# Altium project carrier board Ultrafiltrasi.PrjPCB
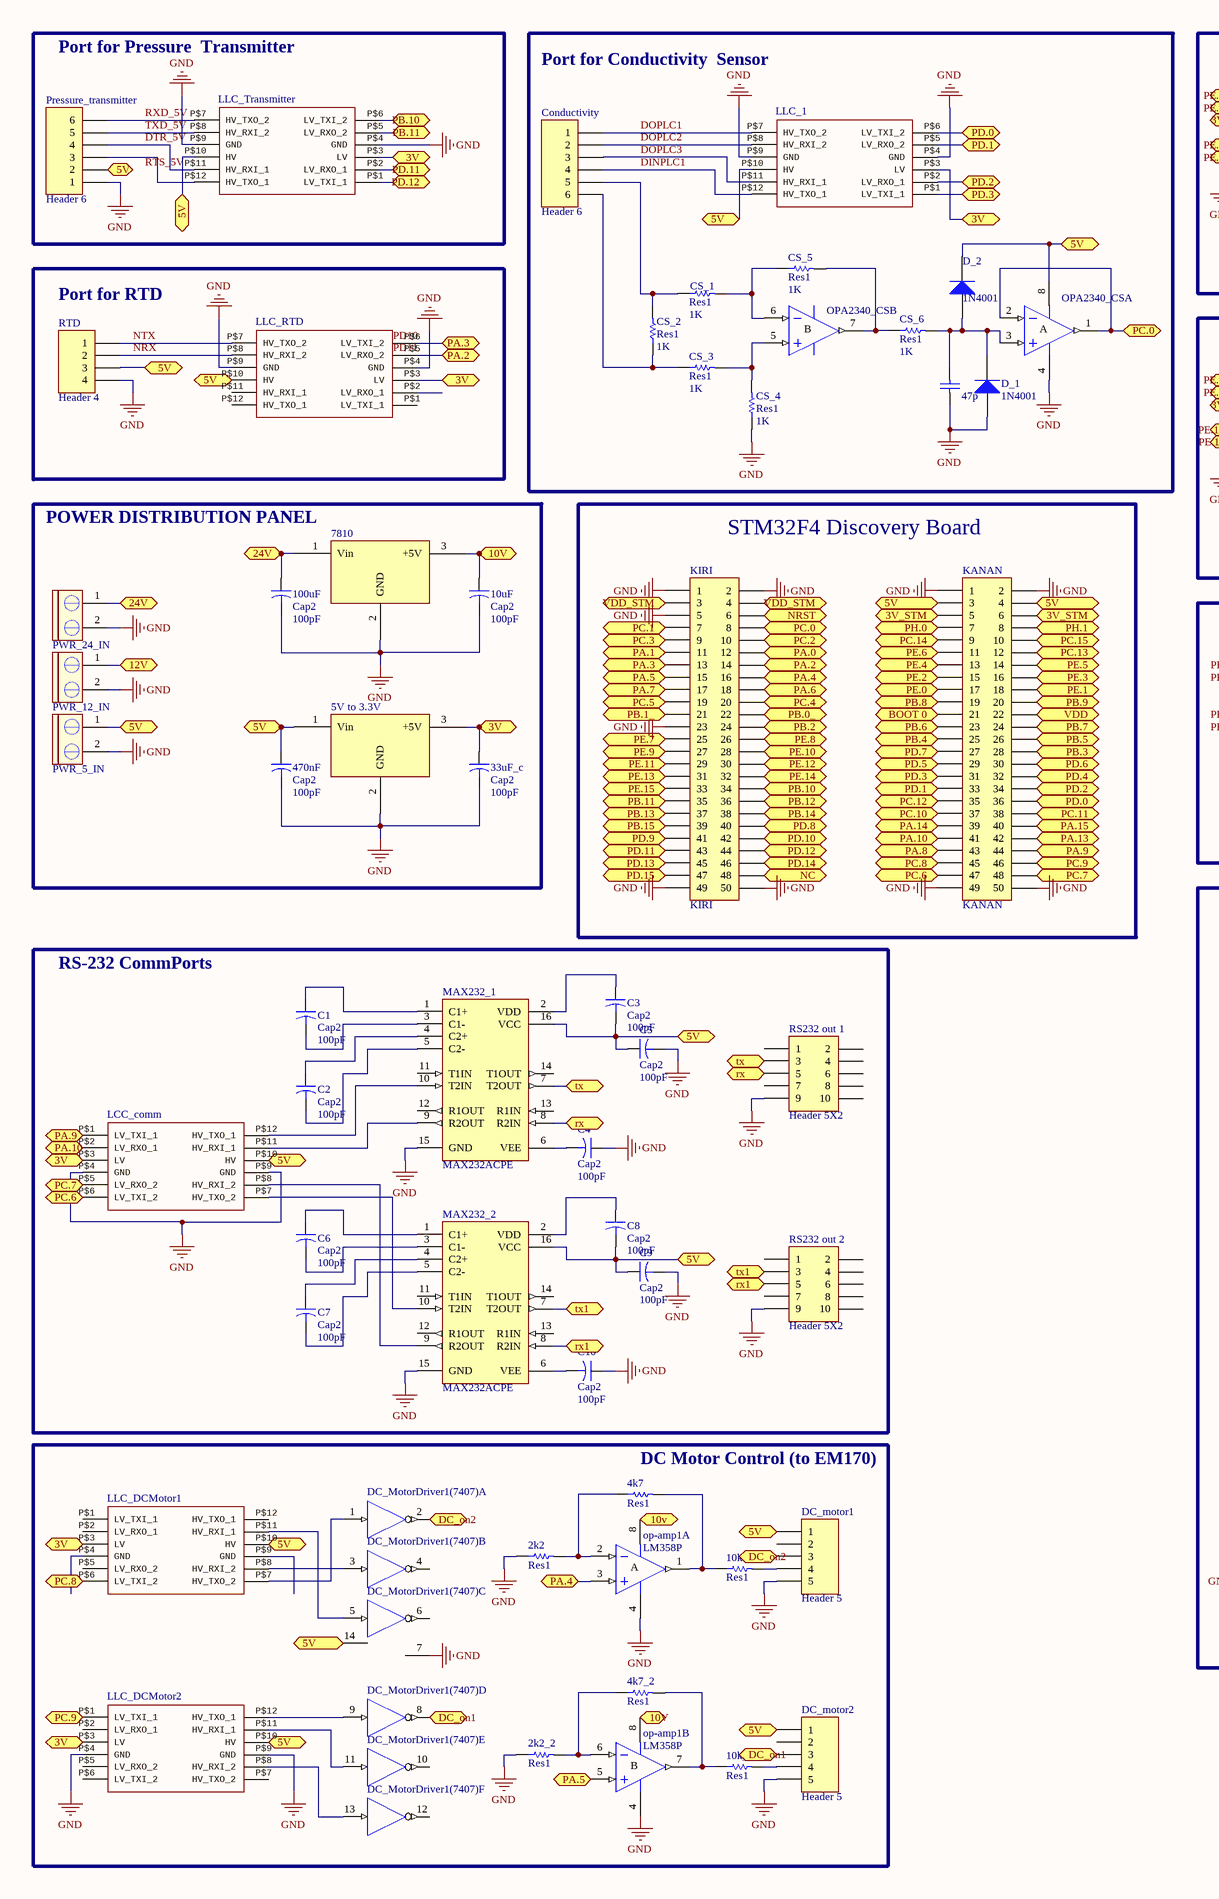
[diagram p0: carrier board Ultrafiltrasi.SchDoc, left]
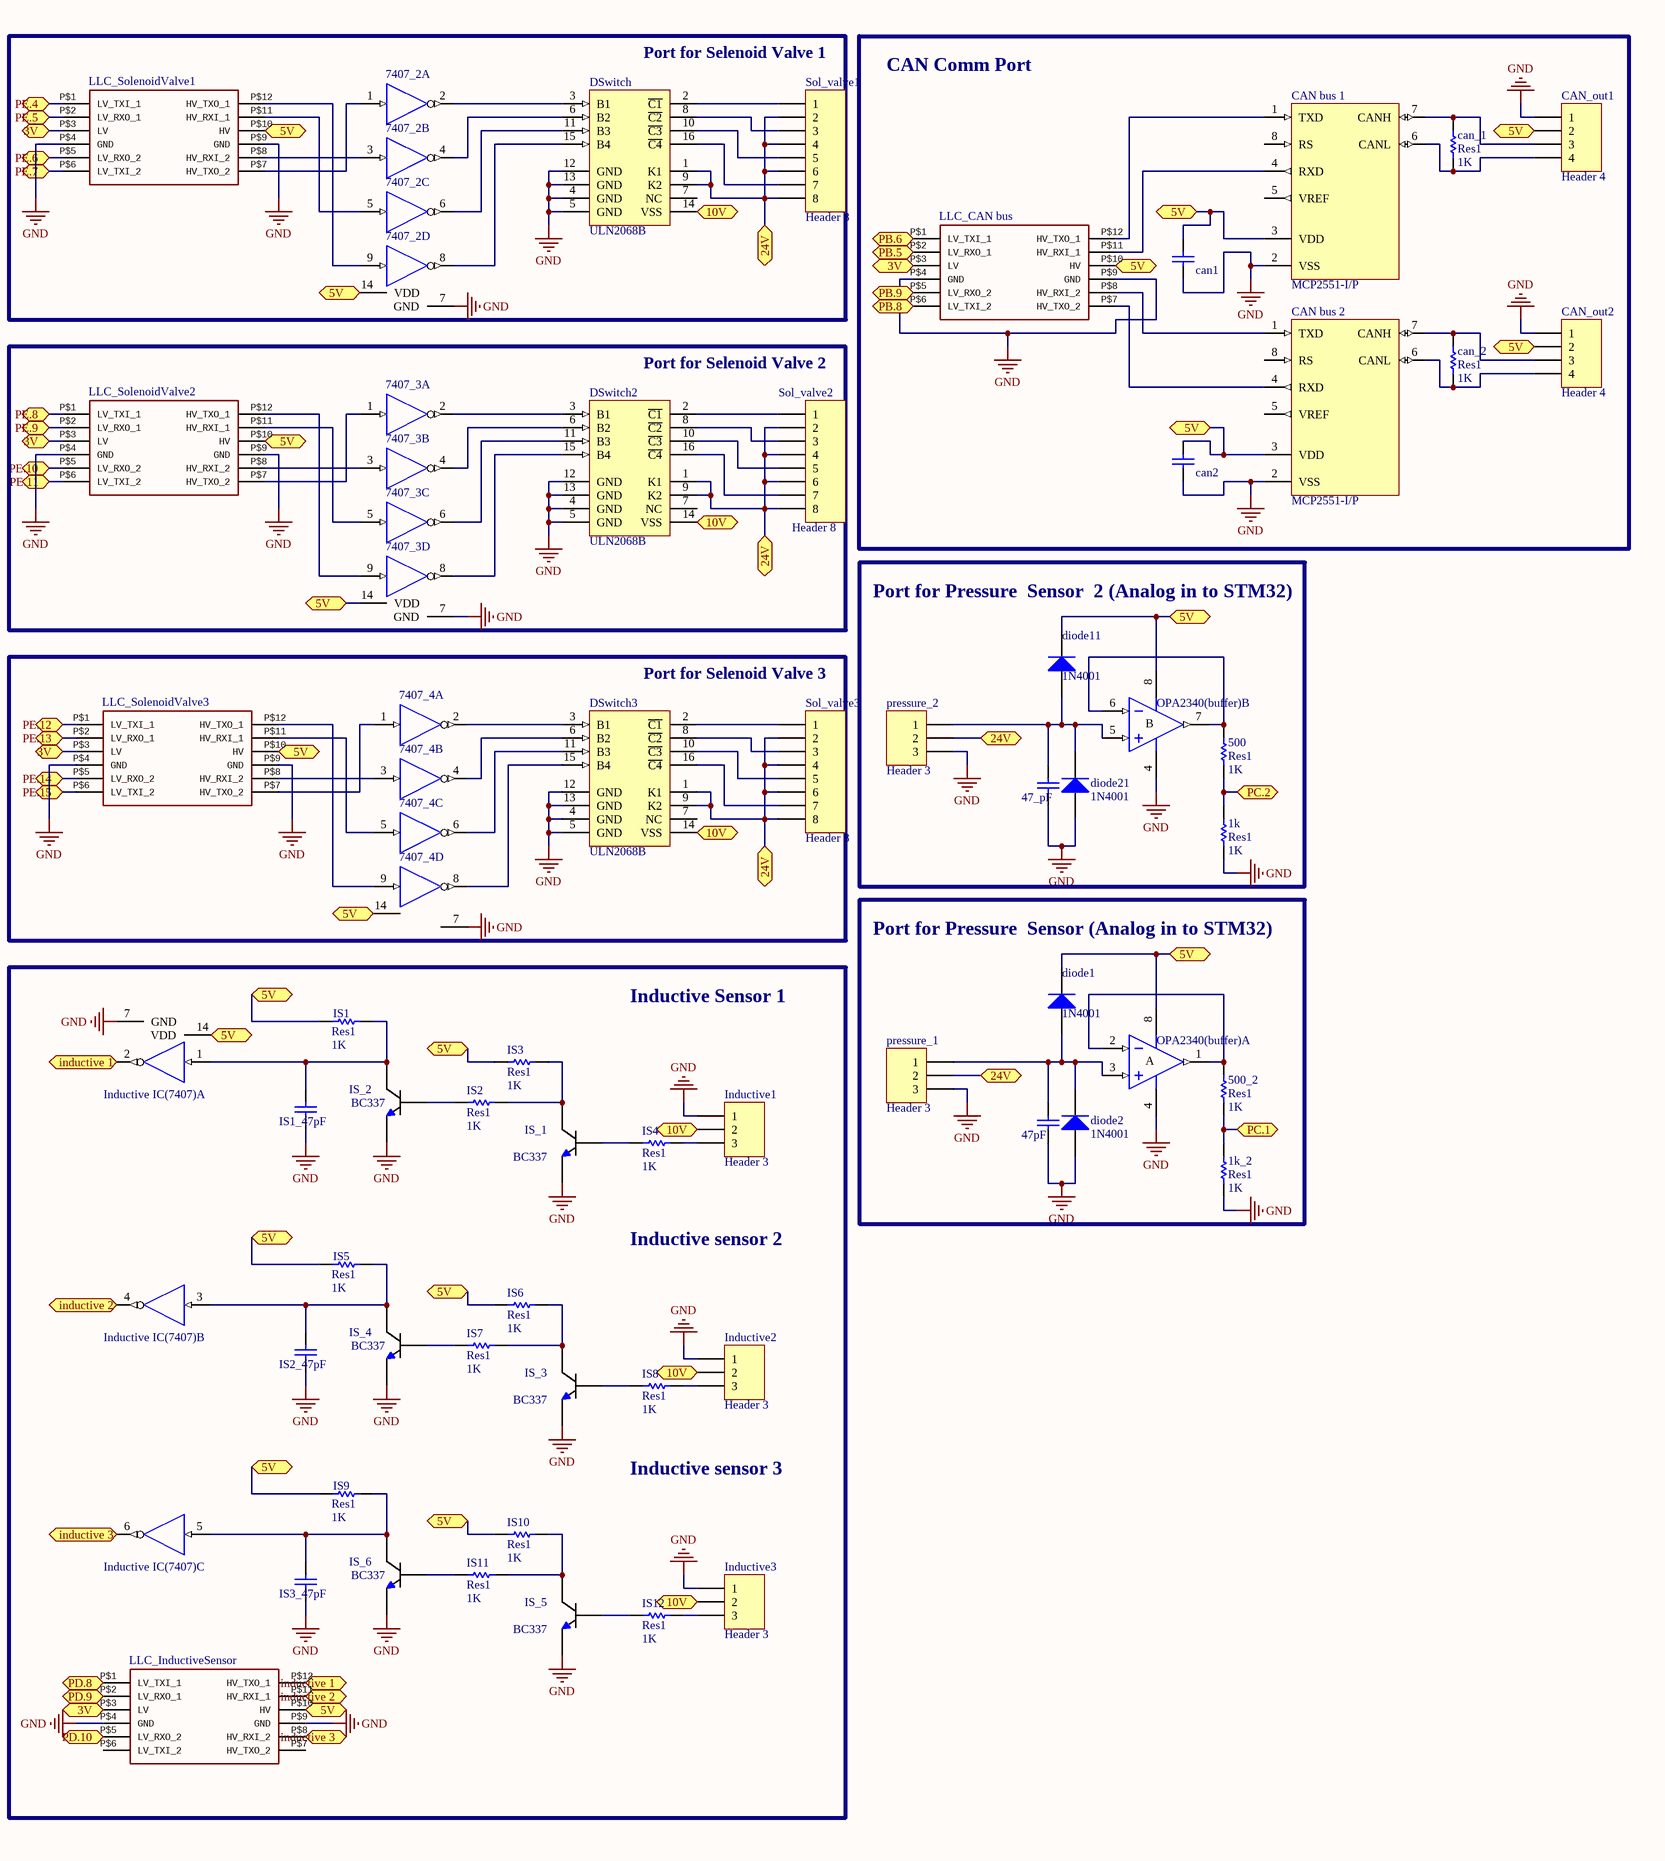
[diagram p1: carrier board Ultrafiltrasi.SchDoc, right]
1 sheet, 114 parts. Net scope: flat (ports and power ports of the same name join across sheets).
Board file: carrier board Ultrafiltrasi.PcbDoc

## Sheet carrier board Ultrafiltrasi.SchDoc: Carrier Board Ultrafiltrasi
size A2

### Parts
1k  Res1  value 1K  [AXIAL-0.3]
1k_2  Res1  value 1K  [AXIAL-0.3]
2k2  Res1  [AXIAL-0.3]
2k2_2  Res1  [AXIAL-0.3]
4k7  Res1  [AXIAL-0.3]
4k7_2  Res1  [AXIAL-0.3]
5V_to_3.3V  7805  [My_TO-220]  (value not drawn)
10k  Res1  [AXIAL-0.3]
10k_2  Res1  [AXIAL-0.3]
10uF  Cap2  value 100pF  [CAPR5-4X5]
33uF_c  Cap2  value 100pF  [CAPR5-4X5]
47_pF  Cap  [My_cap100n]  (value not drawn)
47p  Cap  [My_cap100n]  (value not drawn)
47pF  Cap  [My_cap100n]  (value not drawn)
100uF  Cap2  value 100pF  [CAPR5-4X5]
470nF  Cap2  value 100pF  [CAPR5-4X5]
500  Res1  value 1K  [AXIAL-0.3]
500_2  Res1  value 1K  [AXIAL-0.3]
7407_2  7407  [646-06]  (value not drawn)  (parts A,B,C,D of 6)
7407_3  7407  [646-06]  (value not drawn)  (parts A,B,C,D of 6)
7407_4  7407  [646-06]  (value not drawn)  (parts A,B,C,D of 6)
7810  7805  [My_TO-220]  (value not drawn)
C1  Cap2  value 100pF  [CAPR5-4X5]
C2  Cap2  value 100pF  [CAPR5-4X5]
C3  Cap2  value 100pF  [CAPR5-4X5]
C4  Cap2  value 100pF  [CAPR5-4X5]
C5  Cap2  value 100pF  [CAPR5-4X5]
C6  Cap2  value 100pF  [CAPR5-4X5]
C7  Cap2  value 100pF  [CAPR5-4X5]
C8  Cap2  value 100pF  [CAPR5-4X5]
C9  Cap2  value 100pF  [CAPR5-4X5]
C10  Cap2  value 100pF  [CAPR5-4X5]
can1  Cap  [My_cap100n]  (value not drawn)
can2  Cap  [My_cap100n]  (value not drawn)
can_1  Res1  value 1K  [AXIAL-0.3]
can_2  Res1  value 1K  [AXIAL-0.3]
CAN_bus_1  MCP2551-I/P  [PDIP300-P8]
CAN_bus_2  MCP2551-I/P  [PDIP300-P8]
CAN_out1  Header 4  [HDR1X4]
CAN_out2  Header 4  [HDR1X4]
Conductivity  Header 6  [HDR1X6]
CS_1  Res1  value 1K  [AXIAL-0.3]
CS_2  Res1  value 1K  [AXIAL-0.3]
CS_3  Res1  value 1K  [AXIAL-0.3]
CS_4  Res1  value 1K  [AXIAL-0.3]
CS_5  Res1  value 1K  [AXIAL-0.3]
CS_6  Res1  value 1K  [AXIAL-0.3]
D_1  1N4001  [DO-41]
D_2  1N4001  [DO-41]
DC_motor1  Header 5  [HDR1X5]
DC_motor2  Header 5  [HDR1X5]
DC_MotorDriver1(7407)  SN74LS14N  [646-06]  (value not drawn)  (parts A,B,C,D,E,F of 6)
diode1  1N4001  [DO-41]
diode2  1N4001  [DO-41]
diode11  1N4001  [DO-41]
diode21  1N4001  [DO-41]
DSwitch  ULN2068B  [648C-02]
DSwitch2  ULN2068B  [648C-02]
DSwitch3  ULN2068B  [648C-02]
Inductive1  Header 3  [HDR1X3]
Inductive2  Header 3  [HDR1X3]
Inductive3  Header 3  [HDR1X3]
Inductive_IC(7407)  SN74LS14N  [646-06]  (value not drawn)  (parts A,B,C of 6)
IS1  Res1  value 1K  [AXIAL-0.3]
IS1_47pF  Cap  [My_cap100n]  (value not drawn)
IS2  Res1  value 1K  [AXIAL-0.3]
IS2_47pF  Cap  [My_cap100n]  (value not drawn)
IS3  Res1  value 1K  [AXIAL-0.3]
IS3_47pF  Cap  [My_cap100n]  (value not drawn)
IS4  Res1  value 1K  [AXIAL-0.3]
IS5  Res1  value 1K  [AXIAL-0.3]
IS6  Res1  value 1K  [AXIAL-0.3]
IS7  Res1  value 1K  [AXIAL-0.3]
IS8  Res1  value 1K  [AXIAL-0.3]
IS9  Res1  value 1K  [AXIAL-0.3]
IS10  Res1  value 1K  [AXIAL-0.3]
IS11  Res1  value 1K  [AXIAL-0.3]
IS12  Res1  value 1K  [AXIAL-0.3]
IS_1  BC337  [E3]
IS_2  BC337  [TO-92]
IS_3  BC337  [TO-92]
IS_4  BC337  [transistor]
IS_5  BC337  [TO-92]
IS_6  BC337  [TO-92]
KANAN  KANAN  [HDR2X25]
KIRI  KIRI  [HDR2X25]
LCC_comm  Logic Level Converter (3.3v - 5v) / https://www.sparkfun.com/products/8745  [LOGIC_LEVEL_CONVERTER]  (value not drawn)
LLC_1  Logic Level Converter (3.3v - 5v) / https://www.sparkfun.com/products/8745  [LOGIC_LEVEL_CONVERTER]  (value not drawn)
LLC_CAN_bus  Logic Level Converter (3.3v - 5v) / https://www.sparkfun.com/products/8745  [LOGIC_LEVEL_CONVERTER]  (value not drawn)
LLC_DCMotor1  Logic Level Converter (3.3v - 5v) / https://www.sparkfun.com/products/8745  [LOGIC_LEVEL_CONVERTER]  (value not drawn)
LLC_DCMotor2  Logic Level Converter (3.3v - 5v) / https://www.sparkfun.com/products/8745  [LOGIC_LEVEL_CONVERTER]  (value not drawn)
LLC_InductiveSensor  Logic Level Converter (3.3v - 5v) / https://www.sparkfun.com/products/8745  [LOGIC_LEVEL_CONVERTER]  (value not drawn)
LLC_RTD  Logic Level Converter (3.3v - 5v) / https://www.sparkfun.com/products/8745  [LOGIC_LEVEL_CONVERTER]  (value not drawn)
LLC_SolenoidValve1  Logic Level Converter (3.3v - 5v) / https://www.sparkfun.com/products/8745  [LOGIC_LEVEL_CONVERTER]  (value not drawn)
LLC_SolenoidValve2  Logic Level Converter (3.3v - 5v) / https://www.sparkfun.com/products/8745  [LOGIC_LEVEL_CONVERTER]  (value not drawn)
LLC_SolenoidValve3  Logic Level Converter (3.3v - 5v) / https://www.sparkfun.com/products/8745  [LOGIC_LEVEL_CONVERTER]  (value not drawn)
LLC_Transmitter  Logic Level Converter (3.3v - 5v) / https://www.sparkfun.com/products/8745  [LOGIC_LEVEL_CONVERTER]  (value not drawn)
MAX232_1  MAX232ACPE  [PE16A]
MAX232_2  MAX232ACPE  [PE16A]
op-amp1  LM358P  [P008]  (parts A,B of 2)
OPA2340(buffer)  LM358P  [P008]  (value not drawn)  (parts A,B of 2)
OPA2340_CS  LM358P  [P008]  (value not drawn)  (parts A,B of 2)
pressure_1  Header 3  [HDR1X3]
pressure_2  Header 3  [HDR1X3]
Pressure_transmitter  Header 6  [HDR1X6]
PWR_5_IN  CON2 pin blue  [My_CN2]  (value not drawn)
PWR_12_IN  CON2 pin blue  [My_CN2]  (value not drawn)
PWR_24_IN  CON2 pin blue  [My_CN2]  (value not drawn)
RS232_out_1  Header 5X2  [HDR2X5]
RS232_out_2  Header 5X2  [HDR2X5]
RTD  Header 4  [HDR1X4]
Sol_valve1  Header 8  [HDR1X8]
Sol_valve2  Header 8  [HDR1X8]
Sol_valve3  Header 8  [HDR1X8]

### Blocks framed on the sheet
Port for Pressure  Transmitter: LLC_Transmitter Pressure_transmitter
Port for Conductivity  Sensor: 47p Conductivity CS_1-CS_6 D_1 D_2 LLC_1 OPA2340_CS
Port for Selenoid Valve 1: 7407_2 DSwitch LLC_SolenoidValve1 Sol_valve1
CAN Comm Port: can1 can2 can_1 can_2 CAN_bus_1 CAN_bus_2 CAN_out1 CAN_out2 LLC_CAN_bus
Port for RTD: LLC_RTD RTD
Port for Selenoid Valve 2: 7407_3 DSwitch2 LLC_SolenoidValve2 Sol_valve2
POWER DISTRIBUTION PANEL: 5V_to_3.3V 10uF 33uF_c 100uF 470nF 7810 PWR_5_IN PWR_12_IN PWR_24_IN
STM32F4 Discovery Board: KANAN KIRI
Port for Pressure  Sensor  2 (Analog in to STM32): 1k 47_pF 500 diode11 diode21 OPA2340(buffer) pressure_2
Port for Selenoid Valve 3: 7407_4 DSwitch3 LLC_SolenoidValve3 Sol_valve3
Port for Pressure  Sensor (Analog in to STM32): 1k_2 47pF 500_2 diode1 diode2 OPA2340(buffer) pressure_1
RS-232 CommPorts: C1-C10 LCC_comm MAX232_1 MAX232_2 RS232_out_1 RS232_out_2
DC Motor Control (to EM170): 2k2 2k2_2 4k7 4k7_2 10k 10k_2 DC_motor1 DC_motor2 DC_MotorDriver1(7407) LLC_DCMotor1 LLC_DCMotor2 op-amp1

### Ports
3V, 3V_STM, 5V, 10V, 10v, 12V, 24V, BOOT 0, DC_on1, DC_on2, inductive 1, inductive 2, inductive 3, NC, NRST, PA.0, PA.1, PA.2, PA.3, PA.4, PA.5, PA.6, PA.7, PA.8, PA.9, PA.10, PA.13, PA.14, PA.15, PB.0_, PB.1_, PB.2, PB.3, PB.4, PB.5, PB.6, PB.7, PB.8, PB.9, PB.10, PB.11, PB.12, PB.13, PB.14, PB.15, PC.0, PC.1, PC.2, PC.3, PC.4, PC.5, PC.6, PC.7, PC.8, PC.9, PC.10, PC.11, PC.12, PC.13, PC.14, PC.15, PD.0, PD.1, PD.2, PD.3, PD.4, PD.5, PD.6, PD.7, PD.8, PD.9, PD.10, PD.11, PD.12, PD.13, PD.14, PD.15, PE.0, PE.1, PE.2, PE.3, PE.4, PE.5, PE.6, PE.7, PE.8, PE.9, PE.10, PE.11, PE.12, PE.13, PE.14, PE.15, PH.0, PH.1, rx, rx1, tx, tx1, VDD, VDD_STM

### Nets
GND: 1k.1 1k_2.1 2k2.1 2k2_2.1 5V_to_3.3V.2(GND) 10uF.2 33uF_c.2 47_pF.1 47p.1 47pF.1 100uF.2 470nF.2 7407_2.7(GND) 7407_3.7(GND) 7407_4.7(GND) 7810.2(GND) C4.1 C5.2 C9.2 C10.1 can1.1 can2.1 CAN_bus_1.2(VSS) CAN_bus_2.2(VSS) CAN_out1.1 CAN_out2.1 CS_4.1 D_1.1(A) DC_motor1.5 DC_motor2.5 DC_MotorDriver1(7407).7(GND) diode2.1(A) diode21.1(A) DSwitch.4(GND) DSwitch.5(GND) DSwitch.12(GND) DSwitch.13(GND) DSwitch2.4(GND) DSwitch2.5(GND) DSwitch2.12(GND) DSwitch2.13(GND) DSwitch3.4(GND) DSwitch3.5(GND) DSwitch3.12(GND) DSwitch3.13(GND) Inductive1.1 Inductive2.1 Inductive3.1 Inductive_IC(7407).7(GND) IS1_47pF.1 IS2_47pF.1 IS3_47pF.1 IS_1.3(E) IS_2.3(E) IS_3.3(E) IS_4.3(E) IS_5.3(E) IS_6.3(E) KANAN.1 KANAN.2 KANAN.49 KANAN.50 KIRI.1 KIRI.2 KIRI.5 KIRI.23 KIRI.49 KIRI.50 LCC_comm.P$4(GND) LCC_comm.P$9(GND) LLC_1.P$4(GND) LLC_1.P$9(GND) LLC_CAN_bus.P$4(GND) LLC_CAN_bus.P$9(GND) LLC_DCMotor2.P$4(GND) LLC_DCMotor2.P$9(GND) LLC_InductiveSensor.P$4(GND) LLC_InductiveSensor.P$9(GND) LLC_RTD.P$4(GND) LLC_RTD.P$9(GND) LLC_SolenoidValve1.P$4(GND) LLC_SolenoidValve1.P$9(GND) LLC_SolenoidValve2.P$4(GND) LLC_SolenoidValve2.P$9(GND) LLC_SolenoidValve3.P$4(GND) LLC_SolenoidValve3.P$9(GND) LLC_Transmitter.P$4(GND) LLC_Transmitter.P$9(GND) MAX232_1.15(GND) MAX232_2.15(GND) op-amp1.4(V-) OPA2340(buffer).4(V-) OPA2340_CS.4(V-) pressure_1.3 pressure_2.3 Pressure_transmitter.1 PWR_5_IN.2 PWR_12_IN.2 PWR_24_IN.2 RS232_out_1.9 RS232_out_2.9 RTD.4
VDD: 7407_2.14(VDD) 7407_3.14(VDD) 7407_4.14(VDD) DC_MotorDriver1(7407).14(VDD) Inductive_IC(7407).14(VDD)
DINPLC1: Conductivity.4 LLC_1.P$12(HV_TXO_1)
DOPLC1: Conductivity.1 LLC_1.P$7(HV_TXO_2)
DOPLC2: Conductivity.2 LLC_1.P$8(HV_RXI_2)
DOPLC3: Conductivity.3 LLC_1.P$11(HV_RXI_1)
DTR_5V: LLC_Transmitter.P$11(HV_RXI_1) Pressure_transmitter.4
NRX: LLC_RTD.P$8(HV_RXI_2) RTD.2
NTX: LLC_RTD.P$7(HV_TXO_2) RTD.1
RXD_5V: LLC_Transmitter.P$7(HV_TXO_2) Pressure_transmitter.6
TXD_5V: LLC_Transmitter.P$8(HV_RXI_2) Pressure_transmitter.5
Net1k_2: 1k.2 500.1 KIRI.10 ; port PC.2
Net1k_2_2: 1k_2.2 500_2.1 KIRI.7 ; port PC.1
Net2k2_2: 2k2.2 4k7.1 op-amp1.2(IN-)
Net2k2_2_2: 2k2_2.2 4k7_2.1 op-amp1.6(IN-)
Net4k7_2: 4k7.2 10k.1 op-amp1.1(OUT)
Net4k7_2_2: 4k7_2.2 10k_2.1 op-amp1.7(OUT)
Net5V_to_3.3V_1: 5V_to_3.3V.1(Vin) 470nF.1 7407_2.14(VDD) 7407_3.14(VDD) 7407_4.14(VDD) C3.2 C5.1 C8.2 C9.1 can1.2 can2.2 CAN_bus_1.3(VDD) CAN_bus_2.3(VDD) CAN_out1.2 CAN_out2.2 D_2.2(K) DC_motor1.1 DC_motor2.1 DC_MotorDriver1(7407).14(VDD) diode1.2(K) diode11.2(K) Inductive_IC(7407).14(VDD) IS1.1 IS3.1 IS5.1 IS6.1 IS9.1 IS10.1 KANAN.3 KANAN.4 LCC_comm.P$10(HV) LLC_1.P$10(HV) LLC_CAN_bus.P$10(HV) LLC_DCMotor1.P$10(HV) LLC_DCMotor2.P$10(HV) LLC_InductiveSensor.P$10(HV) LLC_RTD.P$10(HV) LLC_SolenoidValve1.P$10(HV) LLC_SolenoidValve2.P$10(HV) LLC_SolenoidValve3.P$10(HV) LLC_Transmitter.P$10(HV) MAX232_1.16(VCC) MAX232_2.16(VCC) OPA2340(buffer).8(V+) OPA2340_CS.8(V+) Pressure_transmitter.2 PWR_5_IN.1 RTD.3 ; port 5V
Net5V_to_3.3V_3: 5V_to_3.3V.3(+5V) 33uF_c.1 LCC_comm.P$3(LV) LLC_1.P$3(LV) LLC_CAN_bus.P$3(LV) LLC_DCMotor1.P$3(LV) LLC_DCMotor2.P$3(LV) LLC_InductiveSensor.P$3(LV) LLC_RTD.P$3(LV) LLC_SolenoidValve1.P$3(LV) LLC_SolenoidValve2.P$3(LV) LLC_SolenoidValve3.P$3(LV) LLC_Transmitter.P$3(LV) ; port 3V
Net10k_2: 10k.2 DC_motor1.4
Net10k_2_2: 10k_2.2 DC_motor2.4
Net10uF_1: 10uF.1 7810.3(+5V) DSwitch.14(VSS) DSwitch2.14(VSS) DSwitch3.14(VSS) Inductive1.2 Inductive2.2 Inductive3.2 op-amp1.8(V+) ; port 10V, port 10v
Net47_pF_2: 47_pF.2 diode11.1(A) diode21.2(K) OPA2340(buffer).5(IN+) pressure_2.1
Net47p_2: 47p.2 CS_6.2 D_1.2(K) D_2.1(A) OPA2340_CS.3(IN+)
Net47pF_2: 47pF.2 diode1.1(A) diode2.2(K) OPA2340(buffer).3(IN+) pressure_1.1
Net100uF_1: 100uF.1 7810.1(Vin) DSwitch.1(K1) DSwitch.9(K2) DSwitch2.1(K1) DSwitch2.9(K2) DSwitch3.1(K1) DSwitch3.9(K2) pressure_1.2 pressure_2.2 PWR_24_IN.1 Sol_valve1.2 Sol_valve1.4 Sol_valve1.6 Sol_valve1.8 Sol_valve2.2 Sol_valve2.4 Sol_valve2.6 Sol_valve2.8 Sol_valve3.2 Sol_valve3.4 Sol_valve3.6 Sol_valve3.8 ; port 24V
Net500_2: 500.2 OPA2340(buffer).6(IN-) OPA2340(buffer).7(OUT)
Net500_2_2: 500_2.2 OPA2340(buffer).1(OUT) OPA2340(buffer).2(IN-)
Net7407_2_1: 7407_2.1(IN) LLC_SolenoidValve1.P$7(HV_TXO_2)
Net7407_2_2: 7407_2.2(~{OUT}) DSwitch.3(B1)
Net7407_2_3: 7407_2.3(IN) LLC_SolenoidValve1.P$8(HV_RXI_2)
Net7407_2_4: 7407_2.4(~{OUT}) DSwitch.6(B2)
Net7407_2_5: 7407_2.5(IN) LLC_SolenoidValve1.P$11(HV_RXI_1)
Net7407_2_6: 7407_2.6(~{OUT}) DSwitch.11(B3)
Net7407_2_8: 7407_2.8(~{OUT}) DSwitch.15(B4)
Net7407_2_9: 7407_2.9(IN) LLC_SolenoidValve1.P$12(HV_TXO_1)
Net7407_3_1: 7407_3.1(IN) LLC_SolenoidValve2.P$7(HV_TXO_2)
Net7407_3_2: 7407_3.2(~{OUT}) DSwitch2.3(B1)
Net7407_3_3: 7407_3.3(IN) LLC_SolenoidValve2.P$8(HV_RXI_2)
Net7407_3_4: 7407_3.4(~{OUT}) DSwitch2.6(B2)
Net7407_3_5: 7407_3.5(IN) LLC_SolenoidValve2.P$11(HV_RXI_1)
Net7407_3_6: 7407_3.6(~{OUT}) DSwitch2.11(B3)
Net7407_3_8: 7407_3.8(~{OUT}) DSwitch2.15(B4)
Net7407_3_9: 7407_3.9(IN) LLC_SolenoidValve2.P$12(HV_TXO_1)
Net7407_4_1: 7407_4.1(IN) LLC_SolenoidValve3.P$7(HV_TXO_2)
Net7407_4_2: 7407_4.2(~{OUT}) DSwitch3.3(B1)
Net7407_4_3: 7407_4.3(IN) LLC_SolenoidValve3.P$8(HV_RXI_2)
Net7407_4_4: 7407_4.4(~{OUT}) DSwitch3.6(B2)
Net7407_4_5: 7407_4.5(IN) LLC_SolenoidValve3.P$11(HV_RXI_1)
Net7407_4_6: 7407_4.6(~{OUT}) DSwitch3.11(B3)
Net7407_4_8: 7407_4.8(~{OUT}) DSwitch3.15(B4)
Net7407_4_9: 7407_4.9(IN) LLC_SolenoidValve3.P$12(HV_TXO_1)
NetC1_1: C1.1 MAX232_1.1(C1+)
NetC1_2: C1.2 MAX232_1.3(C1-)
NetC2_1: C2.1 MAX232_1.4(C2+)
NetC2_2: C2.2 MAX232_1.5(C2-)
NetC3_1: C3.1 MAX232_1.2(VDD)
NetC4_2: C4.2 MAX232_1.6(VEE)
NetC6_1: C6.1 MAX232_2.1(C1+)
NetC6_2: C6.2 MAX232_2.3(C1-)
NetC7_1: C7.1 MAX232_2.4(C2+)
NetC7_2: C7.2 MAX232_2.5(C2-)
NetC8_1: C8.1 MAX232_2.2(VDD)
NetC10_2: C10.2 MAX232_2.6(VEE)
Netcan_1_1: can_1.1 CAN_bus_1.6(CANL) CAN_out1.4
Netcan_1_2: can_1.2 CAN_bus_1.7(CANH) CAN_out1.3
Netcan_2_1: can_2.1 CAN_bus_2.6(CANL) CAN_out2.4
Netcan_2_2: can_2.2 CAN_bus_2.7(CANH) CAN_out2.3
NetCAN_bus_1_1: CAN_bus_1.1(TXD) LLC_CAN_bus.P$12(HV_TXO_1)
NetCAN_bus_1_4: CAN_bus_1.4(RXD) LLC_CAN_bus.P$11(HV_RXI_1)
NetCAN_bus_2_1: CAN_bus_2.1(TXD) LLC_CAN_bus.P$8(HV_RXI_2)
NetCAN_bus_2_4: CAN_bus_2.4(RXD) LLC_CAN_bus.P$7(HV_TXO_2)
NetConductivity_5: Conductivity.5 CS_1.1 CS_2.2
NetConductivity_6: Conductivity.6 CS_2.1 CS_3.1
NetCS_1_2: CS_1.2 CS_5.1 OPA2340_CS.6(IN-)
NetCS_3_2: CS_3.2 CS_4.2 OPA2340_CS.5(IN+)
NetCS_5_2: CS_5.2 CS_6.1 OPA2340_CS.7(OUT)
NetDC_motor1_3: DC_motor1.3 DC_MotorDriver1(7407).2(~{OUT}) ; port DC_on2
NetDC_motor2_3: DC_motor2.3 DC_MotorDriver1(7407).8(~{OUT}) ; port DC_on1
NetDC_MotorDriver1(7407)_1: DC_MotorDriver1(7407).1(IN) LLC_DCMotor1.P$7(HV_TXO_2)
NetDC_MotorDriver1(7407)_3: DC_MotorDriver1(7407).3(IN) LLC_DCMotor1.P$8(HV_RXI_2)
NetDC_MotorDriver1(7407)_5: DC_MotorDriver1(7407).5(IN) LLC_DCMotor1.P$11(HV_RXI_1)
NetDC_MotorDriver1(7407)_9: DC_MotorDriver1(7407).9(IN) LLC_DCMotor2.P$12(HV_TXO_1)
NetDC_MotorDriver1(7407)_11: DC_MotorDriver1(7407).11(IN) LLC_DCMotor2.P$11(HV_RXI_1)
NetDC_MotorDriver1(7407)_13: DC_MotorDriver1(7407).13(IN) LLC_DCMotor2.P$8(HV_RXI_2)
NetDSwitch2_2: DSwitch2.2(~{C1}) Sol_valve2.1
NetDSwitch2_8: DSwitch2.8(~{C2}) Sol_valve2.3
NetDSwitch2_10: DSwitch2.10(~{C3}) Sol_valve2.5
NetDSwitch2_16: DSwitch2.16(~{C4}) Sol_valve2.7
NetDSwitch3_2: DSwitch3.2(~{C1}) Sol_valve3.1
NetDSwitch3_8: DSwitch3.8(~{C2}) Sol_valve3.3
NetDSwitch3_10: DSwitch3.10(~{C3}) Sol_valve3.5
NetDSwitch3_16: DSwitch3.16(~{C4}) Sol_valve3.7
NetDSwitch_2: DSwitch.2(~{C1}) Sol_valve1.1
NetDSwitch_8: DSwitch.8(~{C2}) Sol_valve1.3
NetDSwitch_10: DSwitch.10(~{C3}) Sol_valve1.5
NetDSwitch_16: DSwitch.16(~{C4}) Sol_valve1.7
NetInductive1_3: Inductive1.3 IS4.2
NetInductive2_3: Inductive2.3 IS8.2
NetInductive3_3: Inductive3.3 IS12.2
NetInductive_IC(7407)_1: Inductive_IC(7407).1(IN) IS1.2 IS1_47pF.2 IS_2.1(C)
NetInductive_IC(7407)_2: Inductive_IC(7407).2(~{OUT}) LLC_InductiveSensor.P$12(HV_TXO_1) ; port inductive 1
NetInductive_IC(7407)_3: Inductive_IC(7407).3(IN) IS2_47pF.2 IS5.2 IS_4.1(C)
NetInductive_IC(7407)_4: Inductive_IC(7407).4(~{OUT}) LLC_InductiveSensor.P$11(HV_RXI_1) ; port inductive 2
NetInductive_IC(7407)_5: Inductive_IC(7407).5(IN) IS3_47pF.2 IS9.2 IS_6.1(C)
NetInductive_IC(7407)_6: Inductive_IC(7407).6(~{OUT}) LLC_InductiveSensor.P$8(HV_RXI_2) ; port inductive 3
NetIS2_1: IS2.1 IS_2.2(B)
NetIS2_2: IS2.2 IS3.2 IS_1.1(C)
NetIS4_1: IS4.1 IS_1.2(B)
NetIS6_2: IS6.2 IS7.2 IS_3.1(C)
NetIS7_1: IS7.1 IS_4.2(B)
NetIS8_1: IS8.1 IS_3.2(B)
NetIS10_2: IS10.2 IS11.2 IS_5.1(C)
NetIS11_1: IS11.1 IS_6.2(B)
NetIS12_1: IS12.1 IS_5.2(B)
NetKANAN_5: KANAN.5 KANAN.6 ; port 3V_STM
NetKANAN_7: KANAN.7 ; port PH.0
NetKANAN_8: KANAN.8 ; port PH.1
NetKANAN_9: KANAN.9 ; port PC.14
NetKANAN_10: KANAN.10 ; port PC.15
NetKANAN_11: KANAN.11 LLC_SolenoidValve1.P$5(LV_RXO_2) ; port PE.6
NetKANAN_12: KANAN.12 ; port PC.13
NetKANAN_13: KANAN.13 LLC_SolenoidValve1.P$1(LV_TXI_1) ; port PE.4
NetKANAN_14: KANAN.14 LLC_SolenoidValve1.P$2(LV_RXO_1) ; port PE.5
NetKANAN_15: KANAN.15 ; port PE.2
NetKANAN_16: KANAN.16 ; port PE.3
NetKANAN_17: KANAN.17 ; port PE.0
NetKANAN_18: KANAN.18 ; port PE.1
NetKANAN_19: KANAN.19 LLC_CAN_bus.P$6(LV_TXI_2) ; port PB.8
NetKANAN_20: KANAN.20 LLC_CAN_bus.P$5(LV_RXO_2) ; port PB.9
NetKANAN_21: KANAN.21 ; port BOOT 0
NetKANAN_22: KANAN.22 ; port VDD
NetKANAN_23: KANAN.23 LLC_CAN_bus.P$1(LV_TXI_1) ; port PB.6
NetKANAN_24: KANAN.24 ; port PB.7
NetKANAN_25: KANAN.25 ; port PB.4
NetKANAN_26: KANAN.26 LLC_CAN_bus.P$2(LV_RXO_1) ; port PB.5
NetKANAN_27: KANAN.27 ; port PD.7
NetKANAN_28: KANAN.28 ; port PB.3
NetKANAN_29: KANAN.29 ; port PD.5
NetKANAN_30: KANAN.30 ; port PD.6
NetKANAN_31: KANAN.31 LLC_1.P$1(LV_TXI_1) ; port PD.3
NetKANAN_32: KANAN.32 ; port PD.4
NetKANAN_33: KANAN.33 LLC_1.P$5(LV_RXO_2) ; port PD.1
NetKANAN_34: KANAN.34 LLC_1.P$2(LV_RXO_1) ; port PD.2
NetKANAN_35: KANAN.35 ; port PC.12
NetKANAN_36: KANAN.36 LLC_1.P$6(LV_TXI_2) ; port PD.0
NetKANAN_37: KANAN.37 ; port PC.10
NetKANAN_38: KANAN.38 ; port PC.11
NetKANAN_39: KANAN.39 ; port PA.14
NetKANAN_40: KANAN.40 ; port PA.15
NetKANAN_41: KANAN.41 LCC_comm.P$2(LV_RXO_1) ; port PA.10
NetKANAN_42: KANAN.42 ; port PA.13
NetKANAN_43: KANAN.43 ; port PA.8
NetKANAN_44: KANAN.44 LCC_comm.P$1(LV_TXI_1) ; port PA.9
NetKANAN_45: KANAN.45 LLC_DCMotor1.P$6(LV_TXI_2) ; port PC.8
NetKANAN_46: KANAN.46 LLC_DCMotor2.P$1(LV_TXI_1) ; port PC.9
NetKANAN_47: KANAN.47 LCC_comm.P$6(LV_TXI_2) ; port PC.6
NetKANAN_48: KANAN.48 LCC_comm.P$5(LV_RXO_2) ; port PC.7
NetKIRI_3: KIRI.3 KIRI.4 ; port VDD_STM
NetKIRI_6: KIRI.6 ; port NRST
NetKIRI_8: KIRI.8 OPA2340_CS.1(OUT) OPA2340_CS.2(IN-) ; port PC.0
NetKIRI_9: KIRI.9 ; port PC.3
NetKIRI_11: KIRI.11 ; port PA.1
NetKIRI_12: KIRI.12 ; port PA.0
NetKIRI_13: KIRI.13 LLC_RTD.P$6(LV_TXI_2) ; port PA.3
NetKIRI_14: KIRI.14 LLC_RTD.P$5(LV_RXO_2) ; port PA.2
NetKIRI_15: KIRI.15 op-amp1.5(IN+) ; port PA.5
NetKIRI_16: KIRI.16 op-amp1.3(IN+) ; port PA.4
NetKIRI_17: KIRI.17 ; port PA.7
NetKIRI_18: KIRI.18 ; port PA.6
NetKIRI_19: KIRI.19 ; port PC.5
NetKIRI_20: KIRI.20 ; port PC.4
NetKIRI_21: KIRI.21 ; port PB.1_
NetKIRI_22: KIRI.22 ; port PB.0_
NetKIRI_24: KIRI.24 ; port PB.2
NetKIRI_25: KIRI.25 LLC_SolenoidValve1.P$6(LV_TXI_2) ; port PE.7
NetKIRI_26: KIRI.26 LLC_SolenoidValve2.P$1(LV_TXI_1) ; port PE.8
NetKIRI_27: KIRI.27 LLC_SolenoidValve2.P$2(LV_RXO_1) ; port PE.9
NetKIRI_28: KIRI.28 LLC_SolenoidValve2.P$5(LV_RXO_2) ; port PE.10
NetKIRI_29: KIRI.29 LLC_SolenoidValve2.P$6(LV_TXI_2) ; port PE.11
NetKIRI_30: KIRI.30 LLC_SolenoidValve3.P$1(LV_TXI_1) ; port PE.12
NetKIRI_31: KIRI.31 LLC_SolenoidValve3.P$2(LV_RXO_1) ; port PE.13
NetKIRI_32: KIRI.32 LLC_SolenoidValve3.P$5(LV_RXO_2) ; port PE.14
NetKIRI_33: KIRI.33 LLC_SolenoidValve3.P$6(LV_TXI_2) ; port PE.15
NetKIRI_34: KIRI.34 LLC_Transmitter.P$6(LV_TXI_2) ; port PB.10
NetKIRI_35: KIRI.35 LLC_Transmitter.P$5(LV_RXO_2) ; port PB.11
NetKIRI_36: KIRI.36 ; port PB.12
NetKIRI_37: KIRI.37 ; port PB.13
NetKIRI_38: KIRI.38 ; port PB.14
NetKIRI_39: KIRI.39 ; port PB.15
NetKIRI_40: KIRI.40 LLC_InductiveSensor.P$1(LV_TXI_1) ; port PD.8
NetKIRI_41: KIRI.41 LLC_InductiveSensor.P$2(LV_RXO_1) ; port PD.9
NetKIRI_42: KIRI.42 LLC_InductiveSensor.P$5(LV_RXO_2) ; port PD.10
NetKIRI_43: KIRI.43 LLC_Transmitter.P$2(LV_RXO_1) ; port PD.11
NetKIRI_44: KIRI.44 LLC_Transmitter.P$1(LV_TXI_1) ; port PD.12
NetKIRI_45: KIRI.45 ; port PD.13
NetKIRI_46: KIRI.46 ; port PD.14
NetKIRI_47: KIRI.47 ; port PD.15
NetKIRI_48: KIRI.48 ; port NC
NetLCC_comm_P$7: LCC_comm.P$7(HV_TXO_2) MAX232_2.10(T2IN)
NetLCC_comm_P$8: LCC_comm.P$8(HV_RXI_2) MAX232_2.9(R2OUT)
NetLCC_comm_P$11: LCC_comm.P$11(HV_RXI_1) MAX232_1.9(R2OUT)
NetLCC_comm_P$12: LCC_comm.P$12(HV_TXO_1) MAX232_1.10(T2IN)
NetLLC_Transmitter_P$12: LLC_Transmitter.P$12(HV_TXO_1) Pressure_transmitter.3
NetMAX232_1_7: MAX232_1.7(T2OUT) RS232_out_1.3 ; port tx
NetMAX232_1_8: MAX232_1.8(R2IN) RS232_out_1.5 ; port rx
NetMAX232_2_7: MAX232_2.7(T2OUT) RS232_out_2.3 ; port tx1
NetMAX232_2_8: MAX232_2.8(R2IN) RS232_out_2.5 ; port rx1
NetPWR_12_IN_1: PWR_12_IN.1 ; port 12V

Not connected (* = marked no-connect by the designer): CAN_bus_1 5(VREF) 8(RS); CAN_bus_2 5(VREF) 8(RS); DC_motor1 2; DC_motor2 2; DC_MotorDriver1(7407) 4(~{OUT}) 6(~{OUT}) 10(~{OUT}) 12(~{OUT}); DSwitch 7(NC); DSwitch2 7(NC); DSwitch3 7(NC); LLC_DCMotor1 P$1(LV_TXI_1) P$2(LV_RXO_1) P$4(GND) P$5(LV_RXO_2) P$9(GND) P$12(HV_TXO_1); LLC_DCMotor2 P$2(LV_RXO_1) P$5(LV_RXO_2) P$6(LV_TXI_2) P$7(HV_TXO_2); LLC_InductiveSensor P$6(LV_TXI_2) P$7(HV_TXO_2); LLC_RTD P$1(LV_TXI_1) P$2(LV_RXO_1) P$11(HV_RXI_1) P$12(HV_TXO_1); MAX232_1 11(T1IN) 12(R1OUT) 13(R1IN) 14(T1OUT); MAX232_2 11(T1IN) 12(R1OUT) 13(R1IN) 14(T1OUT); RS232_out_1 1 2 4 6 7 8 10; RS232_out_2 1 2 4 6 7 8 10

### Notes on the sheet
- Inductive Sensor 1
- Inductive sensor 2
- Inductive sensor 3
- Labels drawn without touching a wire or pin: PD10, PD11, RTS_5V
- (in symbol LM358P, part A) A
- (in symbol LM358P, part B) B

### Library data of the parts
1k 1k_2 500 500_2 can_1 can_2 CS_1-CS_6 IS1-IS12 = Res1: Resistor; Published: 8-Jun-2000; LatestRevisionDate: 17-Jul-2002; LatestRevisionNote: Re-released for DXP Platform.; PackageReference: AXIAL-0.3; Publisher: Altium Limited; PackageDescription: Axial Device, Thru-Hole; 2 Leads; 0.3 in Pin Spacing
2k2 2k2_2 4k7 4k7_2 10k_2 = Res1: Resistor; Value: 1K; Published: 8-Jun-2000; LatestRevisionDate: 17-Jul-2002; LatestRevisionNote: Re-released for DXP Platform.; PackageReference: AXIAL-0.3; Publisher: Altium Limited; PackageDescription: Axial Device, Thru-Hole; 2 Leads; 0.3 in Pin Spacing
5V_to_3.3V 7810 = 7805: Regulator
10k = Res1: Resistor; Value: 10k; Published: 8-Jun-2000; LatestRevisionDate: 17-Jul-2002; LatestRevisionNote: Re-released for DXP Platform.; PackageReference: AXIAL-0.3; Publisher: Altium Limited; PackageDescription: Axial Device, Thru-Hole; 2 Leads; 0.3 in Pin Spacing
10uF 33uF_c 100uF 470nF C1-C10 = Cap2: Capacitor; Published: 23-Sep-2002; PackageReference: CAPR5-4X5; Publisher: Altium Limited; PackageDescription: Capacitor; 2 Leads
47_pF 47p 47pF can1 can2 IS1_47pF IS2_47pF IS3_47pF = Cap ceramic: CAP-100Nf; Value: 100nF
7407_2-7407_4 DC_MotorDriver1(7407) Inductive_IC(7407) = SN74LS14N: Hex Schmitt-Trigger Inverter; Published: 15-Apr-2002; DatasheetVersion: 18-Oct-1996; PackageVersion: 1995; PackageReference: 646-06; Publisher: Altium Limited; PackageDescription: DIP; 14 Leads; Row Spacing 7.62 mm; Pitch 2.54 mm; ComponentLink1Description: Manufacturer Link; ComponentLink1URL: http://www.onsemi.com/; ComponentLink2Description: Datasheet; ComponentLink2URL: http://www.onsemi.com/pub/Collateral/SN74LS14-D.PDF
CAN_bus_1 CAN_bus_2 = MCP2551-I/P: High-Speed CAN Transceiver, 8-Pin PDIP, Industrial Temperature; Published: 29-Jan-2009; DatasheetVersion: revE, Jan-2007; PackageVersion: revBB, Aug-2009; PackageReference: PDIP300-P8; Publisher: Altium Limited; PackageDescription: 8-Lead Plastic Dual In-Line (P) - 300 mil Body [PDIP]; Supplier 1: Digi-Key; Supplier Part Number 1: MCP2551-I/P-ND; Supplier 2: Farnell; Supplier Part Number 2: 1292240; Code_JEDEC: MS-001; ComponentLink1Description: Datasheet; ComponentLink1URL: http://ww1.microchip.com/downloads/en/DeviceDoc/21667E.pdf; ComponentLink2Description: Packaging Specification; ComponentLink2URL: http://www.microchip.com/stellent/groups/techpub_sg/documents/packagingspec/en012702.pdf; ComponentLink3Description: Microchip.com Home; ComponentLink3URL: http://www.microchip.com/
CAN_out1 CAN_out2 RTD = Header 4: Header, 4-Pin; LatestRevisionDate: 17-Jul-2002; LatestRevisionNote: Re-released for DXP Platform.; Publisher: Altium Limited
Conductivity Pressure_transmitter = Header 6: Header, 6-Pin; LatestRevisionDate: 17-Jul-2002; LatestRevisionNote: Re-released for DXP Platform.; Publisher: Altium Limited
D_1 D_2 diode1 diode2 diode11 diode21 = Diode 1N4001: 1 Amp General Purpose Rectifier; Published: 8-Jun-2000; LatestRevisionDate: 17-Jul-2002; LatestRevisionNote: Re-released for DXP Platform.; DatasheetVersion: 1998; PackageVersion: Aug-1999; PackageReference: DO-41; Publisher: Altium Limited; PackageDescription: Diode, Axial; Body 5.2 x 2.7 mm (LxDia. max), Lead Dia. 0.86 mm (max); Code_JEDEC: DO-204-AL; ComponentLink1Description: Manufacturer Link; ComponentLink1URL: http://www.fairchildsemi.com/; ComponentLink2Description: Datasheet; ComponentLink2URL: http://www.fairchildsemi.com/ds/1N%2F1N4001.pdf
DC_motor1 DC_motor2 = Header 5: Header, 5-Pin; LatestRevisionDate: 17-Jul-2002; LatestRevisionNote: Re-released for DXP Platform.; Publisher: Altium Limited
DSwitch DSwitch2 DSwitch3 = ULN2068B: Quad 1.5A Darlington Switch; Published: 17-Jul-2002; LatestRevisionDate: 06-Jun-2005; LatestRevisionNote: Stylized 3D Model Added.; DatasheetVersion: 1988; PackageReference: 648C-02; Publisher: Altium Limited; PackageDescription: DIP; 16 Leads; Row Spacing 7.62 mm; Pitch 2.54 mm
Inductive1-Inductive3 pressure_1 pressure_2 = Header 3: Header, 3-Pin; LatestRevisionDate: 17-Jul-2002; LatestRevisionNote: Re-released for DXP Platform.; Publisher: Altium Limited
IS_1-IS_6 = BC337: Transistor, NPN, 300MHz, 40V, 200mA, SOT-23 pkg
KANAN KIRI = Header 25X2: Header, 25-Pin, Dual row; LatestRevisionDate: 17-Jul-2002; LatestRevisionNote: Re-released for DXP Platform.; Publisher: Altium Limited
LCC_comm LLC_1 LLC_CAN_bus LLC_DCMotor1 LLC_DCMotor2 LLC_InductiveSensor LLC_RTD LLC_SolenoidValve1-LLC_SolenoidValve3 LLC_Transmitter = LOGIC_LEVEL_CONVERTER
MAX232_1 MAX232_2 = MAX232ACPE: +5V Powered, Multi-Channel RS-232 Driver/Receiver; Published: 16-Jan-2001; LatestRevisionDate: 29-May-2009; LatestRevisionNote: Component Body Added.; PackageVersion: 1997; PackageReference: PE16A; Publisher: Altium Limited; PackageDescription: DIP, 16-Pin, Row Spacing 7.62 mm, Pitch 2.54 mm; Code_JEDEC: MS-001-BB; ComponentLink1Description: Manufacturer Link; ComponentLink1URL: http://www.maxim-ic.com/; ComponentLink2Description: Datasheet; ComponentLink2URL: http://pdfserv.maxim-ic.com/en/ds/MAX220-MAX249.pdf
op-amp1 OPA2340(buffer) OPA2340_CS = LM358P: Dual Operational Amplifier; Published: 16-Jan-2001; LatestRevisionDate: 04-Mar-2005; LatestRevisionNote: Stylized 3D Model Added.; DatasheetVersion: Jul-1998; PackageVersion: Jun-1999; PackageReference: P008; Publisher: Altium Limited; PackageDescription: DIP; 8 Leads; Row Spacing 7.62 mm; Pitch 2.54 mm; Code_JEDEC: MO-001-AN; ComponentLink1Description: Manufacturer Link; ComponentLink1URL: http://www.ti.com/; ComponentLink2Description: Datasheet; ComponentLink2URL: http://www-s.ti.com/sc/ds/lm358.pdf
PWR_5_IN PWR_12_IN PWR_24_IN = CON2 pin blue: Connector blue screw
RS232_out_1 RS232_out_2 = Header 5X2: Header, 5-Pin, Dual row; LatestRevisionDate: 17-Jul-2002; LatestRevisionNote: Re-released for DXP Platform.; Publisher: Altium Limited
Sol_valve1-Sol_valve3 = Header 8: Header, 8-Pin; LatestRevisionDate: 17-Jul-2002; LatestRevisionNote: Re-released for DXP Platform.; Publisher: Altium Limited